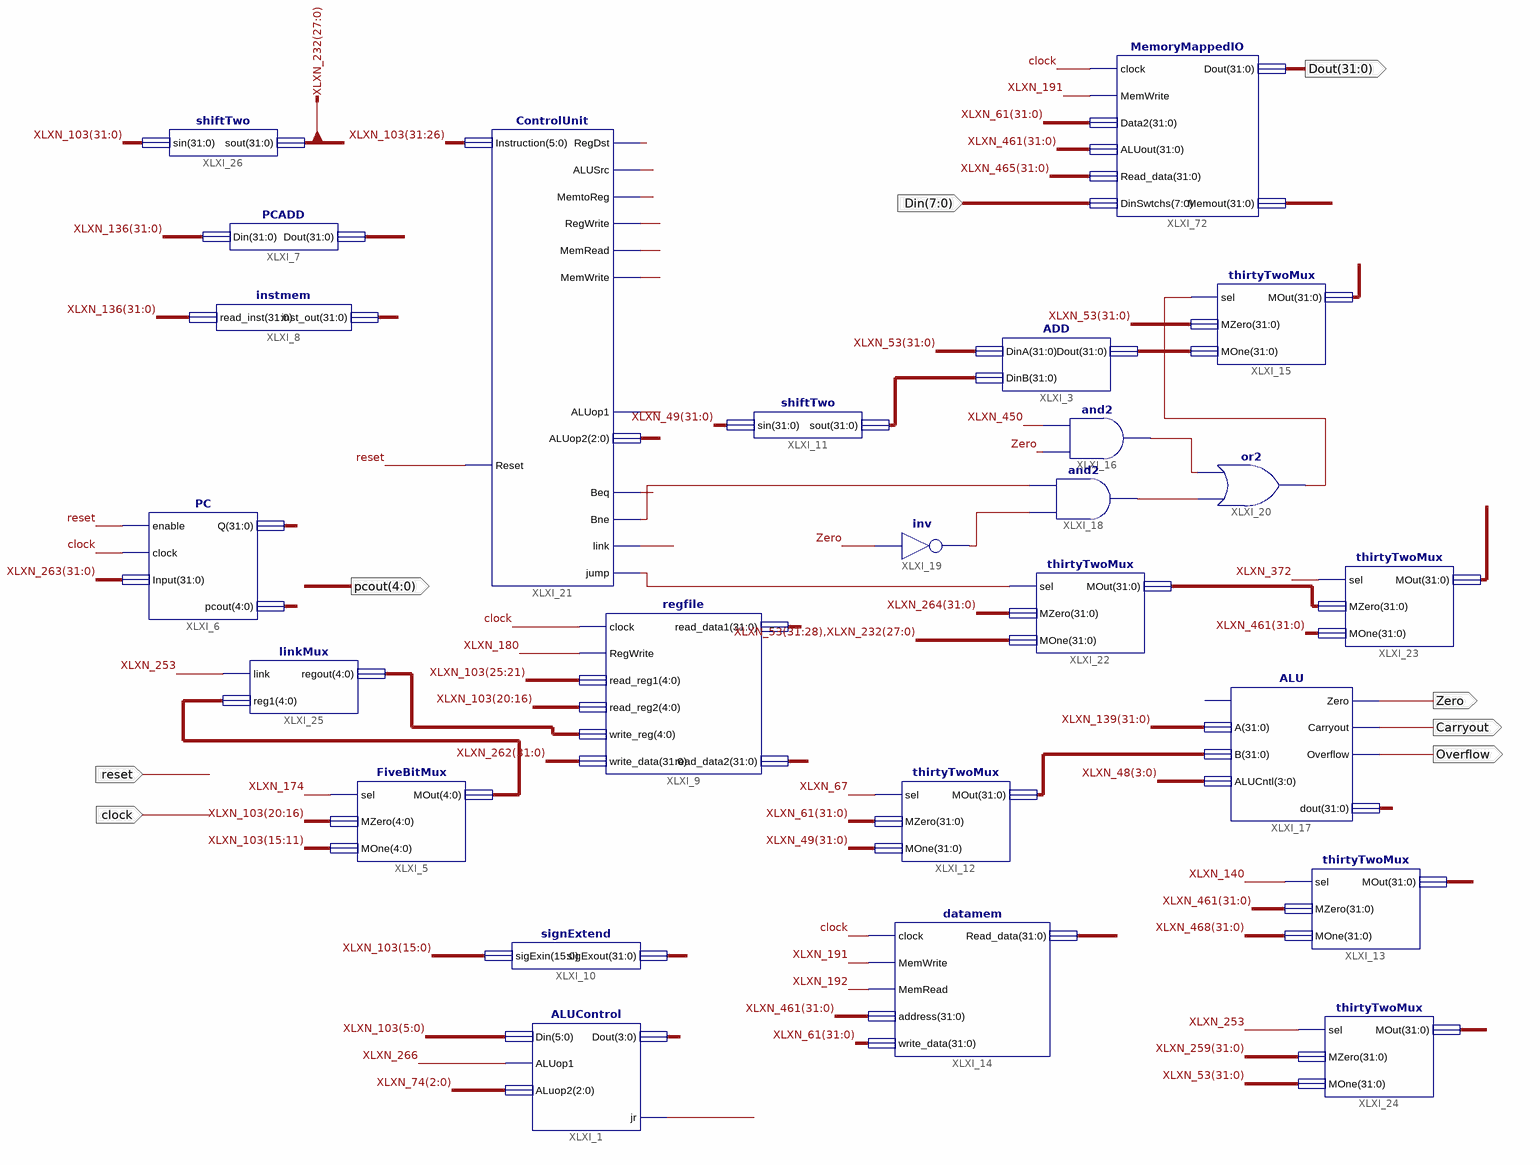
[diagram p0: schematic sheet 1]
// Xilinx ISE schematic Data_Path.sch (spartan3e) as structural Verilog: 25 symbols, 8 ports
module Data_Path (
  input  reset,
  input  clock,
  input  [7:0] Din,
  output [4:0] pcout,
  output Zero,
  output Carryout,
  output Overflow,
  output [31:0] Dout
);

  wire XLXN_67, XLXN_140, XLXN_145, XLXN_146, XLXN_163, XLXN_174, XLXN_180, XLXN_191, XLXN_192, XLXN_242,
       XLXN_253, XLXN_266, XLXN_372, XLXN_434, XLXN_450, XLXN_459;
  wire [2:0] XLXN_74;
  wire [3:0] XLXN_48;
  wire [4:0] XLXN_256, XLXN_257;
  wire [31:0] XLXN_43, XLXN_49, XLXN_51, XLXN_53, XLXN_56, XLXN_61, XLXN_103, XLXN_136, XLXN_139, XLXN_232,
       XLXN_245, XLXN_259, XLXN_262, XLXN_263, XLXN_264, XLXN_461, XLXN_465, XLXN_468;

  FiveBitMux XLXI_5 (.sel(XLXN_174), .MZero(XLXN_103[20:16]), .MOne(XLXN_103[15:11]), .MOut(XLXN_256));
  PC XLXI_6 (.enable(reset), .clock(clock), .Input(XLXN_263), .Q(XLXN_136), .pcout(pcout));
  regfile XLXI_9 (
    .clock(clock), .RegWrite(XLXN_180), .read_reg1(XLXN_103[25:21]), .read_reg2(XLXN_103[20:16]),
    .write_reg(XLXN_257), .write_data(XLXN_262), .read_data1(XLXN_139), .read_data2(XLXN_61));
  thirtyTwoMux XLXI_15 (.sel(XLXN_459), .MZero(XLXN_53), .MOne(XLXN_56), .MOut(XLXN_264));
  and XLXI_16 (XLXN_146, Zero, XLXN_450);
  PCADD XLXI_7 (.Din(XLXN_136), .Dout(XLXN_53));
  instmem XLXI_8 (.read_inst(XLXN_136), .inst_out(XLXN_103));
  or XLXI_20 (XLXN_459, XLXN_145, XLXN_146);
  ControlUnit XLXI_21 (
    .Reset(reset), .Instruction(XLXN_103[31:26]), .link(XLXN_253), .jump(XLXN_242), .RegDst(XLXN_174),
    .ALUSrc(XLXN_67), .MemtoReg(XLXN_140), .RegWrite(XLXN_180), .MemRead(XLXN_192), .MemWrite(XLXN_191),
    .Beq(XLXN_450), .Bne(XLXN_163), .ALUop1(XLXN_266), .ALUop2(XLXN_74));
  linkMux XLXI_25 (.link(XLXN_253), .reg1(XLXN_256), .regout(XLXN_257));
  shiftTwo XLXI_26 (.sin(XLXN_103), .sout(XLXN_232));
  ALUControl XLXI_1 (.ALUop1(XLXN_266), .Din(XLXN_103[5:0]), .ALuop2(XLXN_74), .jr(XLXN_372), .Dout(XLXN_48));
  signExtend XLXI_10 (.sigExin(XLXN_103[15:0]), .sigExout(XLXN_49));
  thirtyTwoMux XLXI_24 (.sel(XLXN_253), .MZero(XLXN_259), .MOne(XLXN_53), .MOut(XLXN_262));
  datamem XLXI_14 (
    .clock(clock), .MemWrite(XLXN_191), .MemRead(XLXN_192), .address(XLXN_461), .write_data(XLXN_61),
    .Read_data(XLXN_465));
  thirtyTwoMux XLXI_13 (.sel(XLXN_140), .MZero(XLXN_461), .MOne(XLXN_468), .MOut(XLXN_259));
  thirtyTwoMux XLXI_12 (.sel(XLXN_67), .MZero(XLXN_61), .MOne(XLXN_49), .MOut(XLXN_43));
  and XLXI_18 (XLXN_145, XLXN_434, XLXN_163);
  ADD XLXI_3 (.DinA(XLXN_53), .DinB(XLXN_51), .Dout(XLXN_56));
  ALU XLXI_17 (
    .A(XLXN_139), .B(XLXN_43), .ALUCntl(XLXN_48), .Zero(Zero), .Carryout(Carryout), .Overflow(Overflow),
    .dout(XLXN_461));  // open: Carryin
  thirtyTwoMux XLXI_23 (.sel(XLXN_372), .MZero(XLXN_245), .MOne(XLXN_461), .MOut(XLXN_263));
  thirtyTwoMux XLXI_22 (.sel(XLXN_242), .MZero(XLXN_264), .MOne({XLXN_53[31:28], XLXN_232[27:0]}), .MOut(XLXN_245));
  not XLXI_19 (XLXN_434, Zero);
  shiftTwo XLXI_11 (.sin(XLXN_49), .sout(XLXN_51));
  MemoryMappedIO XLXI_72 (
    .clock(clock), .MemWrite(XLXN_191), .Data2(XLXN_61), .ALUout(XLXN_461), .Read_data(XLXN_465),
    .DinSwtchs(Din), .Dout(Dout), .Memout(XLXN_468));
endmodule
